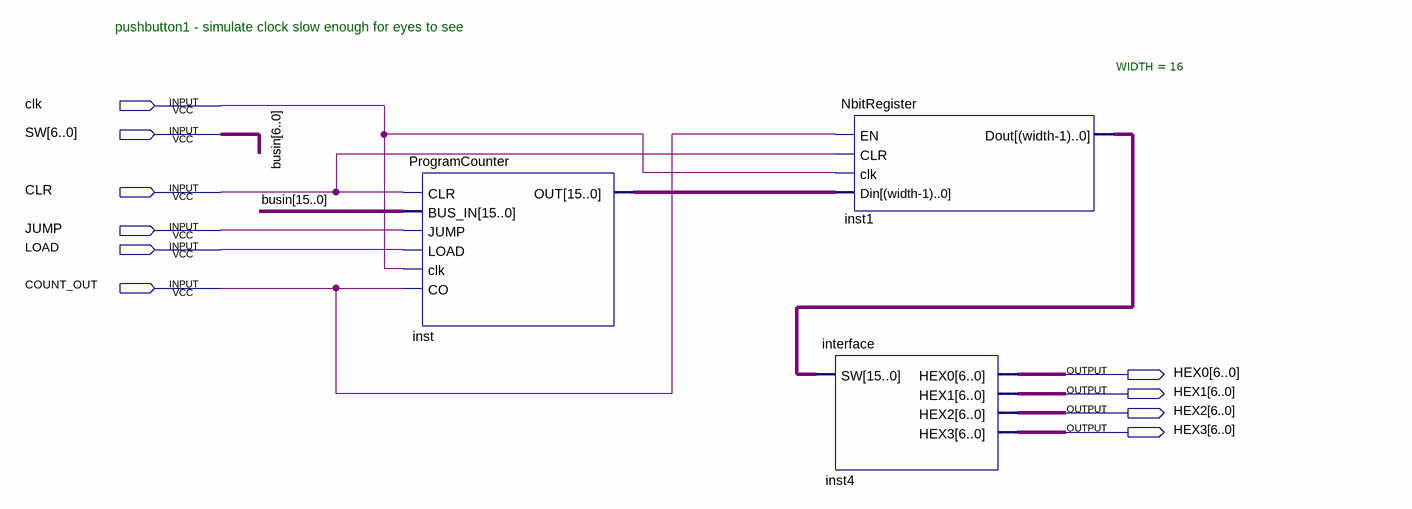
[diagram p0: schematic sheet]
// Quartus schematic ProgramCounterTest.bdf as structural Verilog: 3 symbols, 10 pins
module ProgramCounterTest (
  input  clk,
  input  [6:0] SW,
  input  CLR,
  input  JUMP,
  input  LOAD,
  input  COUNT_OUT,
  output [6:0] HEX0,
  output [6:0] HEX1,
  output [6:0] HEX2,
  output [6:0] HEX3
);

  wire [15:0] inst1_dout, inst_out;
  wire [15:7] busin;

  ProgramCounter inst (
    .CLR(CLR), .BUS_IN({busin, SW}), .JUMP(JUMP), .LOAD(LOAD), .clk(clk), .CO(COUNT_OUT), .OUT(inst_out));
  NbitRegister #(.WIDTH(16)) inst1 (.EN(COUNT_OUT), .CLR(CLR), .clk(clk), .Din(inst_out), .Dout(inst1_dout));
  \interface  inst4 (.SW(inst1_dout), .HEX0(HEX0), .HEX1(HEX1), .HEX2(HEX2), .HEX3(HEX3));

  // Other names for the same wires on the sheet: busin[6:0] = SW

  // Notes on the sheet:
  //   pushbutton1 - simulate clock slow enough for eyes to see
endmodule
